# Altium schematic sheet REUN.ONK.13.000_Electropanel_E2.SchDoc: Щит электрический
size 594 x 420 mm; Date: 22.12.22; ApprovedBy: Шавликов; CheckedBy: Шавликов; DrawnBy: Подлесный; DocumentNumber: РЕУН.ОНК.13.000 Э2 2D; SheetTotal: 1; Format: A2; DocumentType: Схема функциональная; ImagePath: РЕУН.ОНК.13.000 2D
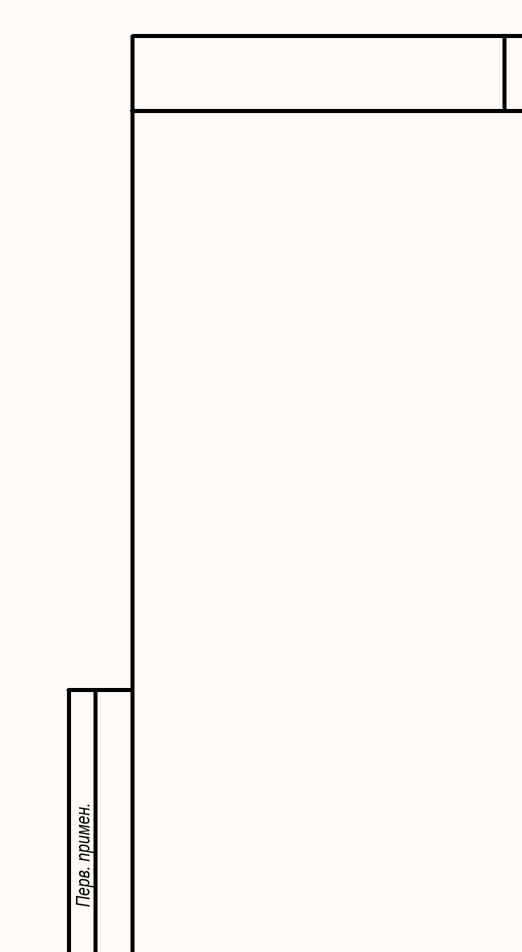
[diagram p0: REUN.ONK.13.000_Electropanel_E2.SchDoc, top left]
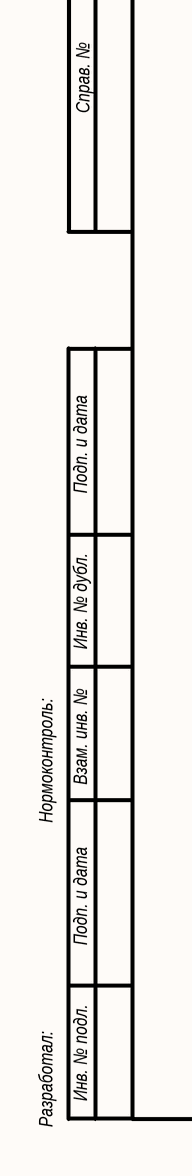
[diagram p1: REUN.ONK.13.000_Electropanel_E2.SchDoc, bottom left]
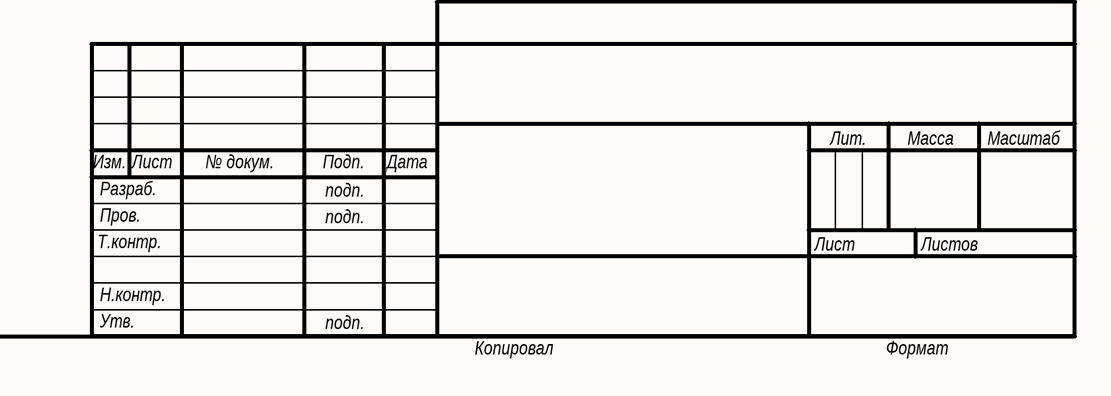
[diagram p2: REUN.ONK.13.000_Electropanel_E2.SchDoc, bottom right]

## Notes on the sheet
- Перв. примен.
- Справ. №
- Подп. и дата
- Инв. № дубл.
- Нормоконтроль:
- Взам. инв. №
- Изм.
- Лист
- № докум.
- Подп.
- Дата
- Лит.
- Масса
- Масштаб
- Т.контр.
- Пров.
- Разраб.
- подп.
- Листов
- Разработал:
- Инв. № подл.
- Н.контр.
- Утв.
- Копировал
- Формат